# Altium schematic sheet Main_Sheet.SchDoc
size A4
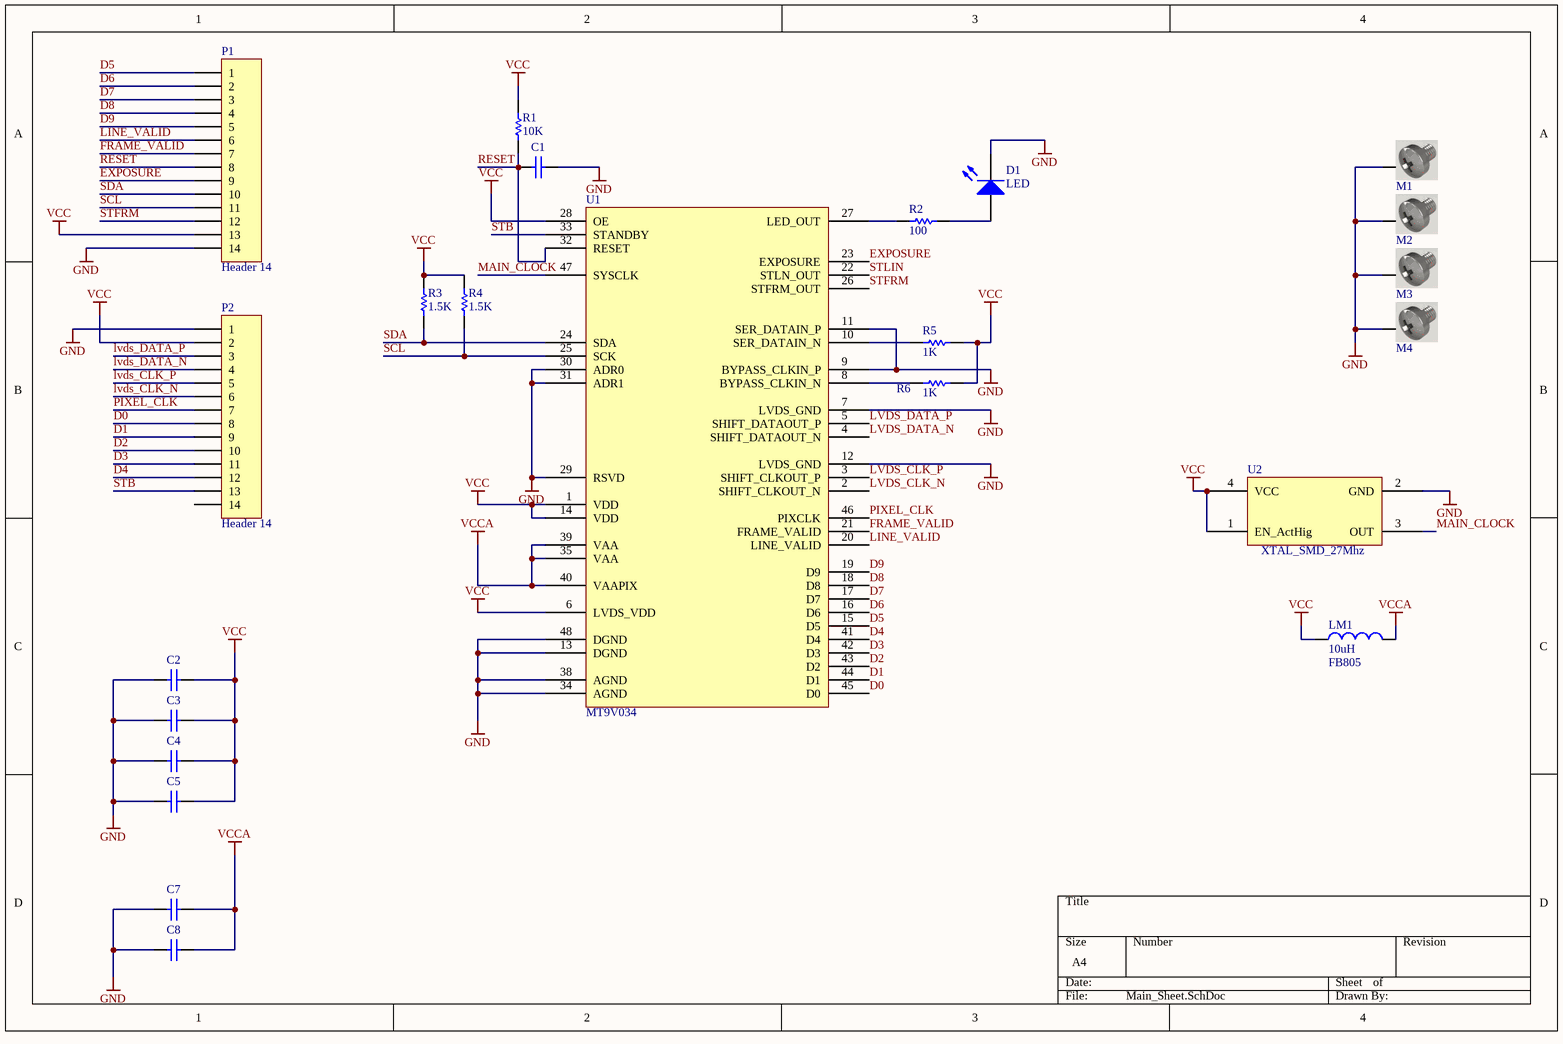
[diagram p0: Main_Sheet.SchDoc]

## Parts
C1  (no value)  [CAP0805]
C2  (no value)  [CAP0805]
C3  (no value)  [CAP0805]
C4  (no value)  [CAP0805]
C5  (no value)  [CAP0805]
C7  (no value)  [CAP0805]
C8  (no value)  [CAP0805]
D1  LED  [My_LED3MM]
LM1  10uH  value FB805  [0805L]
M1  Screw3mm  [Board Screw 3mm]  (value not drawn)
M2  Screw3mm  [Board Screw 3mm]  (value not drawn)
M3  Screw3mm  [Board Screw 3mm]  (value not drawn)
M4  Screw3mm  [Board Screw 3mm]  (value not drawn)
P1  Header 14  [HDR1X14]
P2  Header 14  [HDR1X14]
R1  10K  [RESC3413X04N]
R2  100  [RESC3413X04N]
R3  1.5K  [RESC3413X04N]
R4  1.5K  [RESC3413X04N]
R5  1K  [RESC3413X04N]
R6  1K  [RESC3413X04N]
U1  MT9V034  [MT9V034]
U2  XTAL_SMD_27Mhz  [XTAL_SMD]

## Nets
GND: C1.1 C2.2 C3.2 C4.2 C5.2 C7.2 C8.2 D1.K M1.S M2.S M3.S M4.S P1.14 P2.1 U1.7(LVDS_GND) U1.9(BYPASS_CLKIN_P) U1.11(SER_DATAIN_P) U1.12(LVDS_GND) U1.13(DGND) U1.29(RSVD) U1.30(ADR0) U1.31(ADR1) U1.34(AGND) U1.38(AGND) U1.48(DGND) U2.2(GND)
VCC: C2.1 C3.1 C4.1 C5.1 LM1.1 P1.13 P2.2 R1.2 R3.2 R4.2 R5.2 R6.2 U1.1(VDD) U1.6(LVDS_VDD) U1.14(VDD) U1.28(OE) U2.1(EN_ActHig) U2.4(VCC)
VCCA: C7.1 C8.1 LM1.2 U1.35(VAA) U1.39(VAA) U1.40(VAAPIX)
D0: P2.8 U1.45(D0)
D1: P2.9 U1.44(D1)
D2: P2.10 U1.43(D2)
D3: P2.11 U1.42(D3)
D4: P2.12 U1.41(D4)
D5: P1.1 U1.15(D5)
D6: P1.2 U1.16(D6)
D7: P1.3 U1.17(D7)
D8: P1.4 U1.18(D8)
D9: P1.5 U1.19(D9)
EXPOSURE: P1.9 U1.23(EXPOSURE)
FRAME_VALID: P1.7 U1.21(FRAME_VALID)
LINE_VALID: P1.6 U1.20(LINE_VALID)
LVDS_CLK_N: P2.6 U1.2(SHIFT_CLKOUT_N)
LVDS_CLK_P: P2.5 U1.3(SHIFT_CLKOUT_P)
LVDS_DATA_N: P2.4 U1.4(SHIFT_DATAOUT_N)
LVDS_DATA_P: P2.3 U1.5(SHIFT_DATAOUT_P)
MAIN_CLOCK: U1.47(SYSCLK) U2.3(OUT)
PIXEL_CLK: P2.7 U1.46(PIXCLK)
RESET: C1.2 P1.8 R1.1 U1.32(RESET)
SCL: P1.11 R4.1 U1.25(SCK)
SDA: P1.10 R3.1 U1.24(SDA)
STB: P2.13 U1.33(STANDBY)
STFRM: P1.12 U1.26(STFRM_OUT)
STLIN: U1.22(STLN_OUT)
NetD1_A: D1.A R2.1
NetR2_2: R2.2 U1.27(LED_OUT)
NetR5_1: R5.1 U1.10(SER_DATAIN_N)
NetR6_1: R6.1 U1.8(BYPASS_CLKIN_N)

Not connected (* = marked no-connect by the designer): P2 14

## Library data of the parts
C1-C5 C7 C8 = CAP SMD PACKAGE: TOTAL CAPACITOR SMD PACK; Designer: Abbas Basereh; Desc.: CAP SMD TOTAL PACKAGES; Data: 2017-3-10
D1 = LED: Typical INFRARED GaAs LED; Published: 8-Jun-2000; LatestRevisionDate: 08-Jul-2005; LatestRevisionNote: Mech Layer 1 removed.; Publisher: Altium Limited
LM1 = L SMA 0.25W: Inductor; Code_IEC: 1005; Published: 8-Jun-2000; LatestRevisionDate: 29-May-2009; LatestRevisionNote: IPC-7351 Footprint Added.; PackageReference: 0402-A; Publisher: Altium Limited; PackageDescription: Chip Inductor; Code_JEITA: 0402
M1-M4 = Board Screw 3mm: Board Screw With Spacer 3mm; Designer: Abbas Basereh; Data: 16-12-2016; Link: *; Part. No: *
P1 P2 = Header 14: Header, 14-Pin; LatestRevisionDate: 17-Jul-2002; LatestRevisionNote: Re-released for DXP Platform.; Publisher: Altium Limited
R1-R6 = RES 0805 0.125W: RES 0805; Designer: Abbas Basereh; Desc.: RES SMD 0805; Data: 16-12-2016
U2 = XTAL_SMD